# Altium schematic sheet 19_STEP_MOTOR_DRIVER_1.SchDoc
size 420 x 297 mm; SheetNumber: 23; SheetTotal: 27
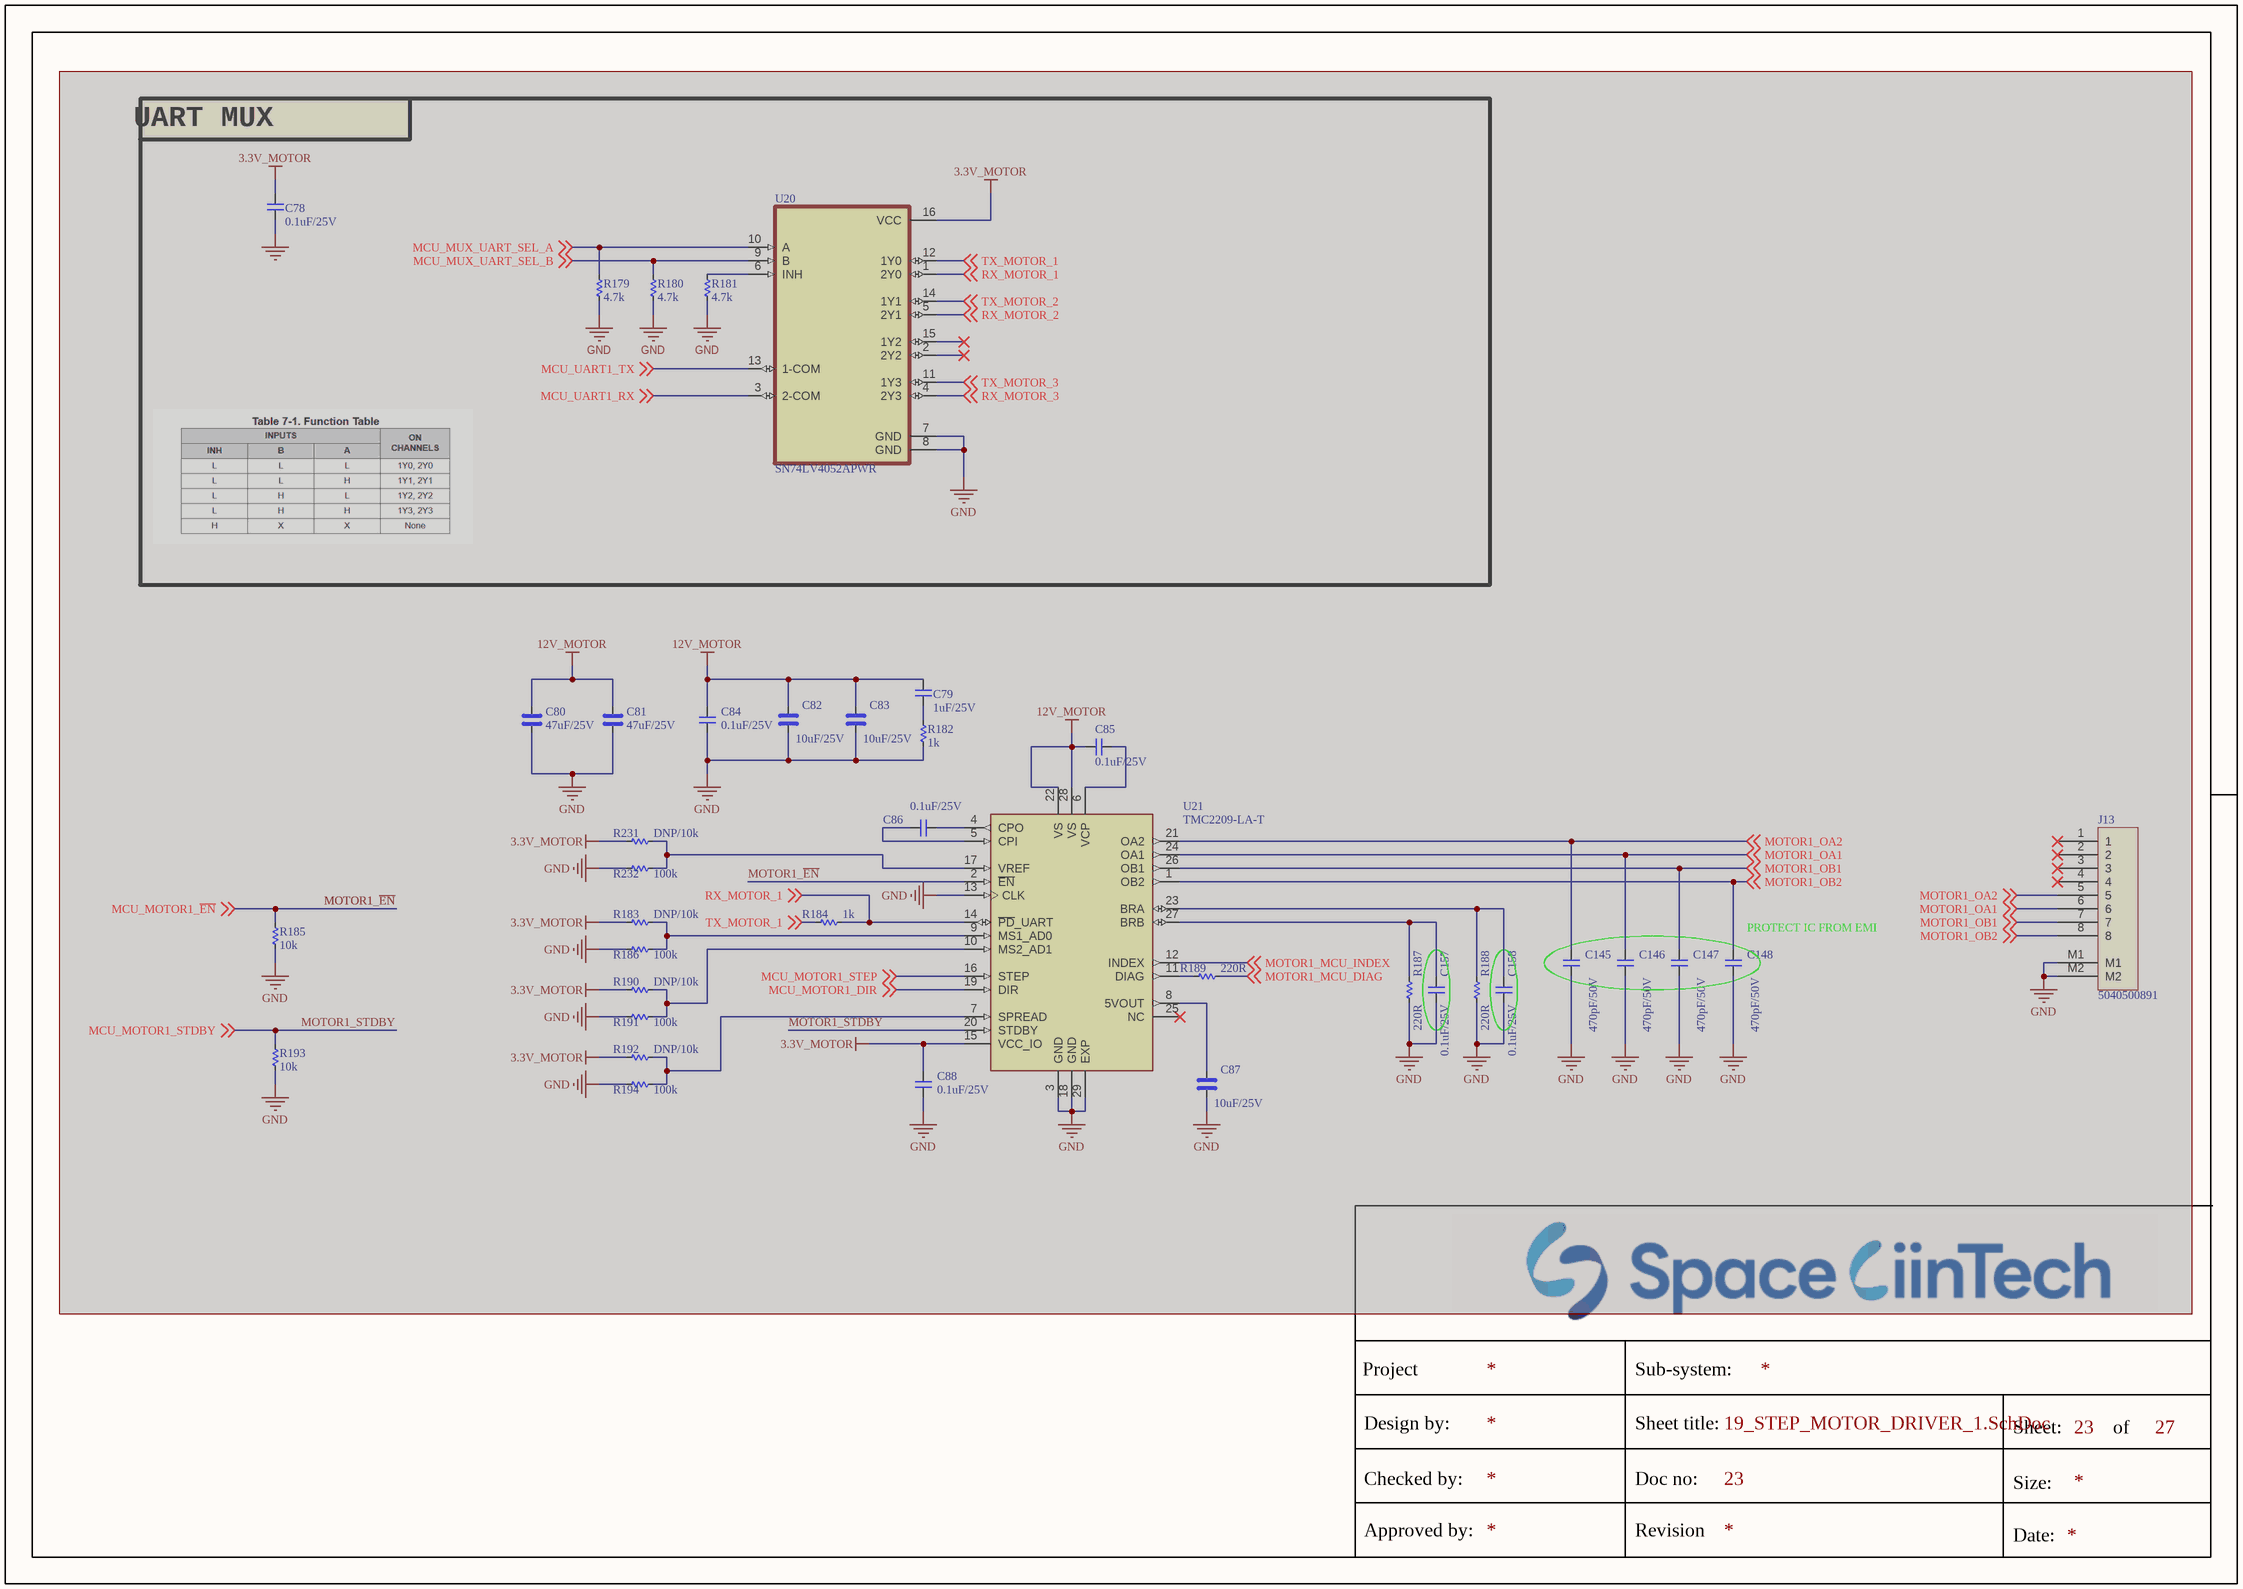
[diagram p0: 19_STEP_MOTOR_DRIVER_1.SchDoc]

## Parts
C78  0.1uF/25V  [CAP_C_1005X60]  (masked out: inside a compile mask, not in the netlist)
C79  1uF/25V  [CAP_C_1005X60]  (masked out: inside a compile mask, not in the netlist)
C80  47uF/25V  [CAP_C_3225X80]  (masked out: inside a compile mask, not in the netlist)
C81  47uF/25V  [CAP_C_3225X80]  (masked out: inside a compile mask, not in the netlist)
C82  10uF/25V  [CAP_C_2012X110]  (masked out: inside a compile mask, not in the netlist)
C83  10uF/25V  [CAP_C_2012X110]  (masked out: inside a compile mask, not in the netlist)
C84  0.1uF/25V  [CAP_C_1005X60]  (masked out: inside a compile mask, not in the netlist)
C85  0.1uF/25V  [CAP_C_1005X60]  (masked out: inside a compile mask, not in the netlist)
C86  0.1uF/25V  [CAP_C_1005X60]  (masked out: inside a compile mask, not in the netlist)
C87  10uF/25V  [CAP_C_2012X110]  (masked out: inside a compile mask, not in the netlist)
C88  0.1uF/25V  [CAP_C_1005X60]  (masked out: inside a compile mask, not in the netlist)
C145  470pF/50V  [CAP_C_1608X80]  (masked out: inside a compile mask, not in the netlist)
C146  470pF/50V  [CAP_C_1608X80]  (masked out: inside a compile mask, not in the netlist)
C147  470pF/50V  [CAP_C_1608X80]  (masked out: inside a compile mask, not in the netlist)
C148  470pF/50V  [CAP_C_1608X80]  (masked out: inside a compile mask, not in the netlist)
C157  0.1uF/25V  [CAP_C_1608X80]  (masked out: inside a compile mask, not in the netlist)
C158  0.1uF/25V  [CAP_C_1608X80]  (masked out: inside a compile mask, not in the netlist)
J13  5040500891  [MOLEX_5040500891]  (masked out: inside a compile mask, not in the netlist)
R179  4.7k  [RES_C_1005X40]  (masked out: inside a compile mask, not in the netlist)
R180  4.7k  [RES_C_1005X40]  (masked out: inside a compile mask, not in the netlist)
R181  4.7k  [RES_C_1005X40]  (masked out: inside a compile mask, not in the netlist)
R182  1k  [RES_C_1005X40]  (masked out: inside a compile mask, not in the netlist)
R183  DNP/10k  [RES_C_1005X40]  (masked out: inside a compile mask, not in the netlist)
R184  1k  [RES_C_1005X40]  (masked out: inside a compile mask, not in the netlist)
R185  10k  [RES_C_1005X40]  (masked out: inside a compile mask, not in the netlist)
R186  100k  [RES_C_1005X40]  (masked out: inside a compile mask, not in the netlist)
R187  220R  [RES_C_1005X40]  (masked out: inside a compile mask, not in the netlist)
R188  220R  [RES_C_1005X40]  (masked out: inside a compile mask, not in the netlist)
R189  220R  [RES_C_1005X40]  (masked out: inside a compile mask, not in the netlist)
R190  DNP/10k  [RES_C_1005X40]  (masked out: inside a compile mask, not in the netlist)
R191  100k  [RES_C_1005X40]  (masked out: inside a compile mask, not in the netlist)
R192  DNP/10k  [RES_C_1005X40]  (masked out: inside a compile mask, not in the netlist)
R193  10k  [RES_C_1005X40]  (masked out: inside a compile mask, not in the netlist)
R194  100k  [RES_C_1005X40]  (masked out: inside a compile mask, not in the netlist)
R231  DNP/10k  [RES_C_1005X40]  (masked out: inside a compile mask, not in the netlist)
R232  100k  [RES_C_1005X40]  (masked out: inside a compile mask, not in the netlist)
U20  SN74LV4052APWR  [SOP65P640X120-16N]  (masked out: inside a compile mask, not in the netlist)
U21  TMC2209-LA-T  [QFN50P500X500X90-29N]  (masked out: inside a compile mask, not in the netlist)

## Blocks framed on the sheet
UART MUX: C78 R179-R181 U20

## Notes on the sheet
- (near C148) PROTECT IC FROM EMI
- Project
- Sub-system:
- Design by:
- Sheet title:
- Sheet:
- of
- Checked by:
- Approved by:
- Doc no:
- Revision
- Size:
- Date:

## Library data of the parts
C78 C79 C84-C86 C88 C145-C148 C157 C158 = _CAP_C_2: CAP
C80-C83 C87 = _CAP_C_High_2: CAP High Value
J13 = Header 8x1_2M
R179-R194 R231 R232 = _RES_B_2: RES
U20 = SN74LV4052APWR: 5-V, 4:1, 2-channel analog multiplexer; MF: Texas Instruments; SnapEDA_Link: https://www.snapeda.com/parts/SN74LV4052APWR/Texas+Instruments/view-part/?ref=snap; Package: TSSOP-16 Texas Instruments; Value: *; MP: SN74LV4052APWR; Check_prices: https://www.snapeda.com/parts/SN74LV4052APWR/Texas+Instruments/view-part/?ref=eda
U21 = TMC2209-LA-T: Bipolar Motor Driver Power MOSFET Step/Direction, UART 28-QFN (5x5); MF: Trinamic Motion Control GmbH; SnapEDA_Link: https://www.snapeda.com/parts/TMC2209-LA-T/Trinamic/view-part/?ref=snap; Package: VFQFN-28 Trinamic; Value: *; MP: TMC2209-LA-T; Check_prices: https://www.snapeda.com/parts/TMC2209-LA-T/Trinamic/view-part/?ref=eda